# Altium schematic sheet highcurrentsensing.SchDoc
size A
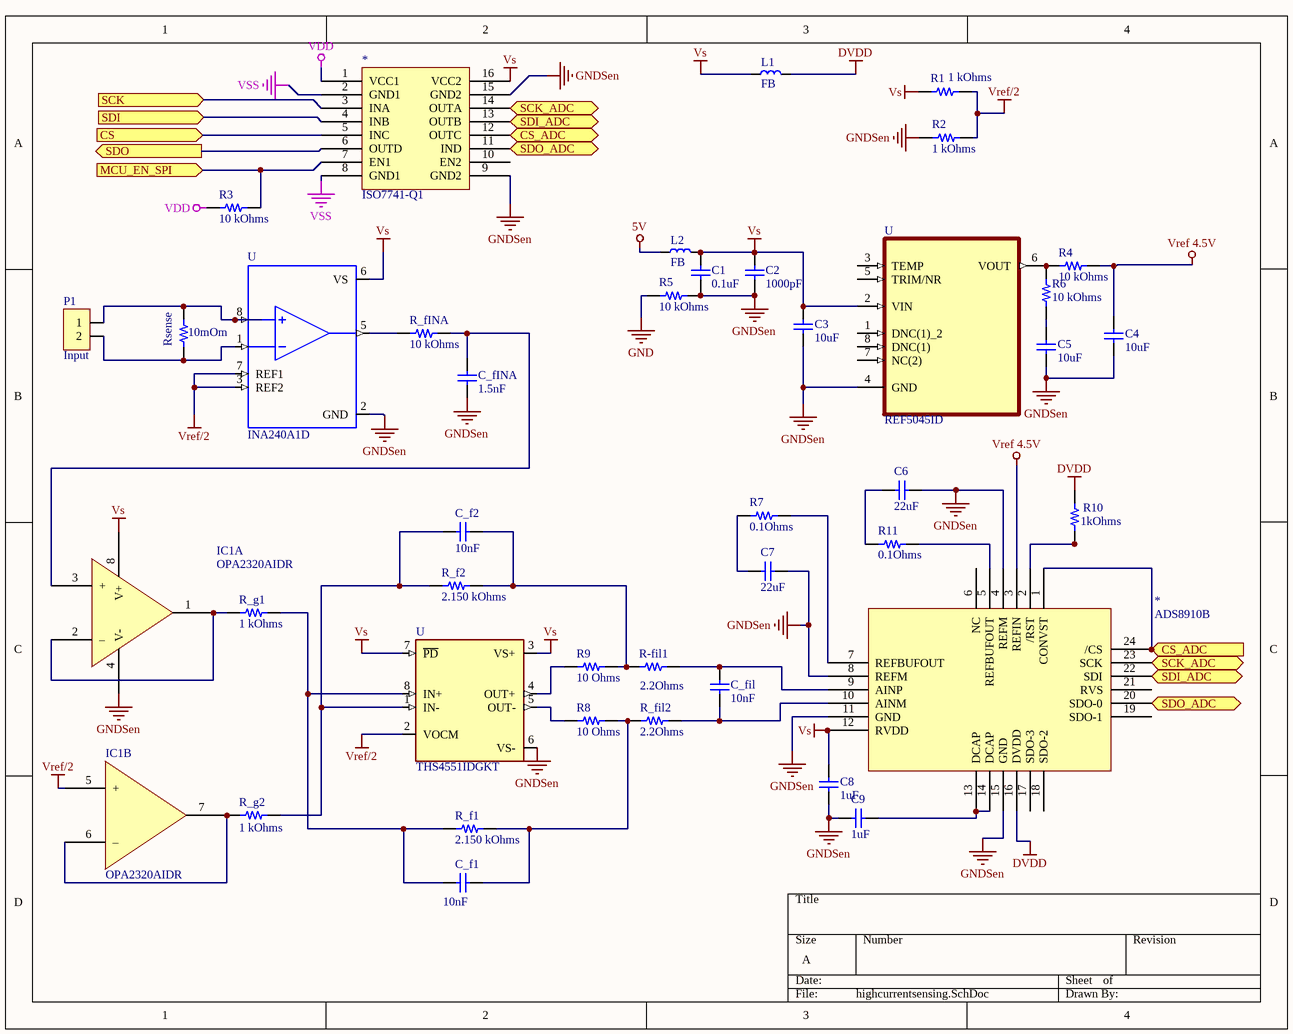
[diagram p0: highcurrentsensing.SchDoc]

## Parts
(Parts that share a designator on the sheet are numbered #1, #2 ... from top to bottom, then left to right.)
10mOm  Part Number: Rsense  [STACKPOLE CSR2512]
*#1  ISO7741-Q1  [*SOIC127P1030X265-16N]
*#2  ADS8910B  [*QFN50P400X400X100-25N]
C1  0.1uF  [C 0603]
C2  1000pF  [C 0603]
C3  10uF  [C 0805]
C4  10uF  [C 0805]
C5  10uF  [C 0805]
C6  22uF  [C 0805]
C7  22uF  [C 0805]
C8  1uF  [C 0805]
C9  1uF  [C 0805]
C_f1  10nF  [C 0805]
C_f2  10nF  [C 0805]
C_fil  10nF  [C 0805]
C_fINA  1.5nF  [C 0805]
IC1  OPA2320AIDR  [TI SOIC-8 D]  (parts A,B of 2)
L1  FB  [L 0805 (2012)]
L2  FB  [L 0805 (2012)]
P1  Input  [HDR/Terminal/2/10mm]
R1  1 kOhms  [RES 0603_1608]
R2  1 kOhms  [RES 0603_1608]
R3  10 kOhms  [RES 0603_1608]
R4  10 kOhms  [RES 0603_1608]
R5  10 kOhms  [RES 0603_1608]
R6  10 kOhms  [RES 0603_1608]
R7  0.1Ohms  [RES 0603_1608]
R8  10 Ohms  [RES 0603_1608]
R9  10 Ohms  [RES 0603_1608]
R10  1kOhms  [RES 0603_1608]
R11  0.1Ohms  [RES 0603_1608]
R-fil1  2.2Ohms  [RES 0603_1608]
R_f1  2.150 kOhms  [RES 0603_1608]
R_f2  2.150 kOhms  [RES 0603_1608]
R_fil2  2.2Ohms  [RES 0603_1608]
R_fINA  10 kOhms  [RES 0603_1608]
R_g1  1 kOhms  [RES 0603_1608]
R_g2  1 kOhms  [RES 0603_1608]
U#1  REF5045ID  [SOIC127P600X175-8N]
U#2  INA240A1D  [SOIC127P600X175-8N]
U#3  THS4551IDGKT  [SOP65P490X110-8N]

## Ports
CS (in), CS_ADC (in), CS_ADC (out), MCU_EN_SPI (in), SCK (in), SCK_ADC (in), SCK_ADC (out), SDI (in), SDI_ADC (in), SDI_ADC (out), SDO (out), SDO_ADC (in), SDO_ADC (out)

## Nets
5V: L2.1
DVDD: *#2.16(DVDD) L1.2 R10.2
GND: R5.2
GNDSen: *#1.9(GND2) *#1.15(GND2) *#2.4(REFM) *#2.8(REFM) *#2.11(GND) *#2.15(GND) C1.2 C2.2 C3.2 C4.2 C5.2 C6.2 C7.2 C8.2 C9.2 C_fINA.2 IC1.4(V-) R2.2 R5.1 U#1.4(GND) U#2.2(GND) U#3.6(VS-)
VDD: *#1.1(VCC1) R3.1
Vref 4.5V: *#2.3(REFIN) C4.1 R4.1
Vref/2: IC1.5(+) R1.2 R2.1 U#2.3(REF2) U#2.7(REF1) U#3.2(VOCM)
Vs: *#1.16(VCC2) *#2.12(RVDD) C1.1 C2.1 C3.1 C8.1 IC1.8(V+) L1.1 L2.2 R1.1 U#1.2(VIN) U#2.6(VS) U#3.3(VS+) U#3.7(~{PD})
VSS: *#1.2(GND1) *#1.8(GND1)
CS: *#1.5(INC) ; port CS
CS_ADC: *#1.12(OUTC) *#2.1(CONVST) *#2.24(/CS) ; port CS_ADC
MCU_EN_SPI: *#1.7(EN1) R3.2 ; port MCU_EN_SPI
SCK: *#1.3(INA) ; port SCK
SCK_ADC: *#1.14(OUTA) *#2.23(SCK) ; port SCK_ADC
SDI: *#1.4(INB) ; port SDI
SDI_ADC: *#1.13(OUTB) *#2.22(SDI) ; port SDI_ADC
SDO: *#1.6(OUTD) ; port SDO
SDO_ADC: *#1.11(IND) *#2.20(SDO-0) ; port SDO_ADC
Net10mOm_1: 10mOm.1 P1.2 U#2.1(IN-)
Net10mOm_2: 10mOm.2 P1.1 U#2.8(IN+)
Net*#2_2: *#2.2(/RST) R10.1
Net*#2_5: *#2.5(REFBUFOUT) R11.1
Net*#2_7: *#2.7(REFBUFOUT) R7.1
Net*#2_9: *#2.9(AINP) C_fil.2 R-fil1.2
Net*#2_10: *#2.10(AINM) C_fil.1 R_fil2.2
Net*#2_13: *#2.13(DCAP) *#2.14(DCAP) C9.1
NetC5_1: C5.1 R6.2
NetC6_1: C6.1 R11.2
NetC7_1: C7.1 R7.2
NetC_f1_1: C_f1.1 R_f1.1 R_g1.2 U#3.8(IN+)
NetC_f1_2: C_f1.2 R8.2 R_f1.2 R_fil2.1
NetC_f2_1: C_f2.1 R_f2.1 R_g2.2 U#3.1(IN-)
NetC_f2_2: C_f2.2 R9.2 R-fil1.1 R_f2.2
NetC_fINA_1: C_fINA.1 IC1.3(+) R_fINA.2
NetIC1_1: IC1.1(OUT_A) IC1.2(–) R_g1.1
NetIC1_6: IC1.6(–) IC1.7(OUT_B) R_g2.1
NetR4_2: R4.2 R6.1 U#1.6(VOUT)
NetR8_1: R8.1 U#3.5(OUT-)
NetR9_1: R9.1 U#3.4(OUT+)
NetR_fINA_1: R_fINA.1 U#2.5(OUT)

Not connected (* = marked no-connect by the designer): *#1 10(EN2); *#2 6(NC) 17(SDO-3) 18(SDO-2) 19(SDO-1) 21(RVS); U#1 1(DNC(1)_2) 3(TEMP) 5(TRIM/NR) 7(NC(2)) 8(DNC(1))

## Library data of the parts
10mOm = CRM2512-JW-201ELF: RES SMD 200 OHM 5% 2W 2512; Package / Case: 2512 (6432 Metric)
C1-C9 = Capacitor NP: CAP CER 0.1UF 50V X7R 0603; TYPE: SMD; PACKAGE: SMD0603; STOCK CODE: CC0603KRX7R9BB104; SUPPLIER: tme.vn; STOCK DESC: 100nF/50V ±10% X7R SMD-0603 Capacitor; UNIT PRICE: 400
C_f1 C_f2 C_fil C_fINA = Capacitor NP: CAP CER 0.1UF 50V X7R 0603; PACKAGE: SMD0603; STOCK CODE: CC0603KRX7R9BB104; SUPPLIER: tme.vn; TYPE: SMD; STOCK DESC: 100nF/50V ±10% X7R SMD-0603 Capacitor; UNIT PRICE: 400
IC1 = OPA2320AIDR: IC OPAMP GP 2 CIRCUIT 8SOIC; Part Number: OPA2320AIDR
L1 L2 = Inductor
P1 = Header 2: Header, 2-Pin; UNIT PRICE: 0
R1-R11 R-fil1 R_f1 R_f2 R_fil2 R_fINA R_g1 R_g2 = RNCS0603BKE10K0: RES 10K OHM 0.1% 1/16W 0603; Part Number: RNCS0603BKE10K0
  R1 R2 R_g1 R_g2: Value: 1 kOhms
  R3-R6 R_fINA: Value: 10 kOhms
  R7 R11: Value: 0.1Ohms
  R8 R9: Value: 10 Ohms
  R10: Value: 1kOhms
  R-fil1 R_fil2: Value: 2.2Ohms
  R_f1 R_f2: Value: 2.150 kOhms
U#1 = REF5045ID: Series Voltage Reference IC Â±0.05% 8-VSSOP; MF: Texas Instruments; SnapEDA_Link: https://www.snapeda.com/parts/REF5045ID/Texas%20Instruments/view-part/1131648/?ref=snap; Availability: Unavailable; DigiKey-Purchase-URL: https://snapeda.com/shop?store=DigiKey&id=1131648; MP: REF5045ID; Package: SOIC-8 Texas Instruments; Value: *; Price: None
U#2 = INA240A1D: Current Sense Amplifier 1 Circuit 8-SOIC; MF: Texas Instruments; Package: SOIC-8 Texas Instruments; MP: INA240A1D; Price: None; Availability: Unavailable; Value: *; SnapEDA_Link: https://www.snapeda.com/parts/INA240A1D/Texas%20Instruments/view-part/2778825/?ref=snap
U#3 = THS4551IDGKT: Differential Amplifier 1 Circuit Rail-to-Rail 8-VSSOP; MF: Texas Instruments; Value: *; SnapEDA_Link: https://www.snapeda.com/parts/THS4551IDGKT/Texas%20Instruments/view-part/649050/?ref=snap; Availability: Unavailable; Package: MSOP-8 Texas Instruments; DigiKey-Purchase-URL: https://snapeda.com/shop?store=DigiKey&id=649050; Price: None; MP: THS4551IDGKT